# EAGLE design revision0 (EAGLE 7.2.0)
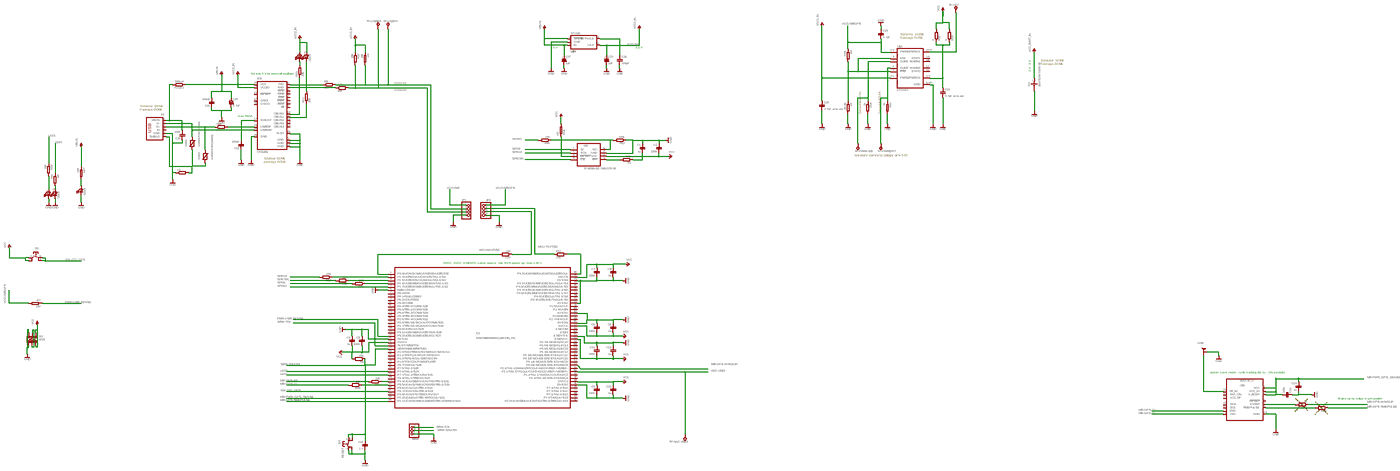
[diagram p0: schematic, sheet 1, overview]
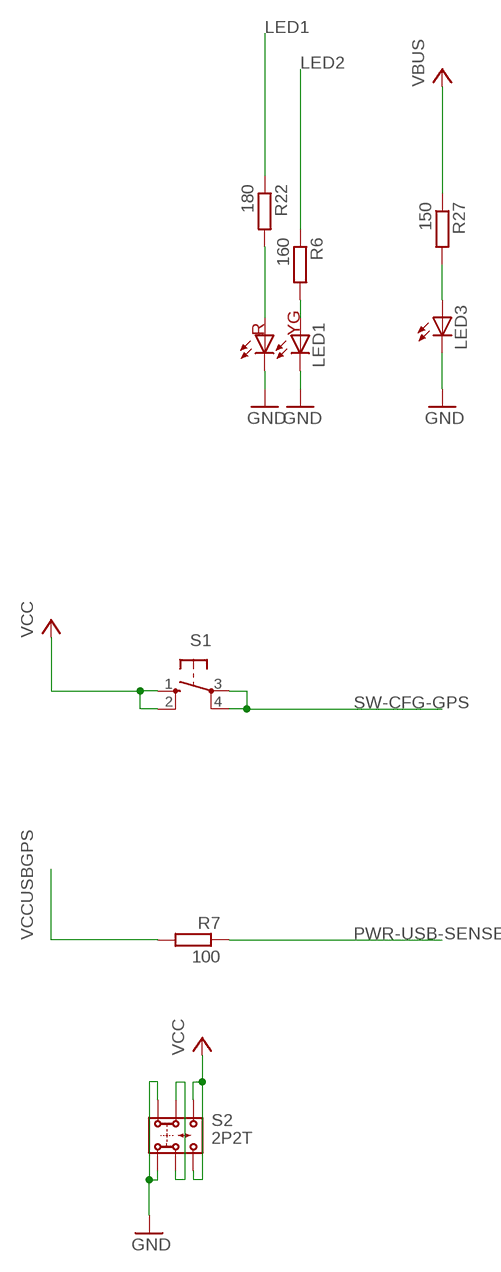
[diagram p1: schematic, sheet 1, part 1 of 4]
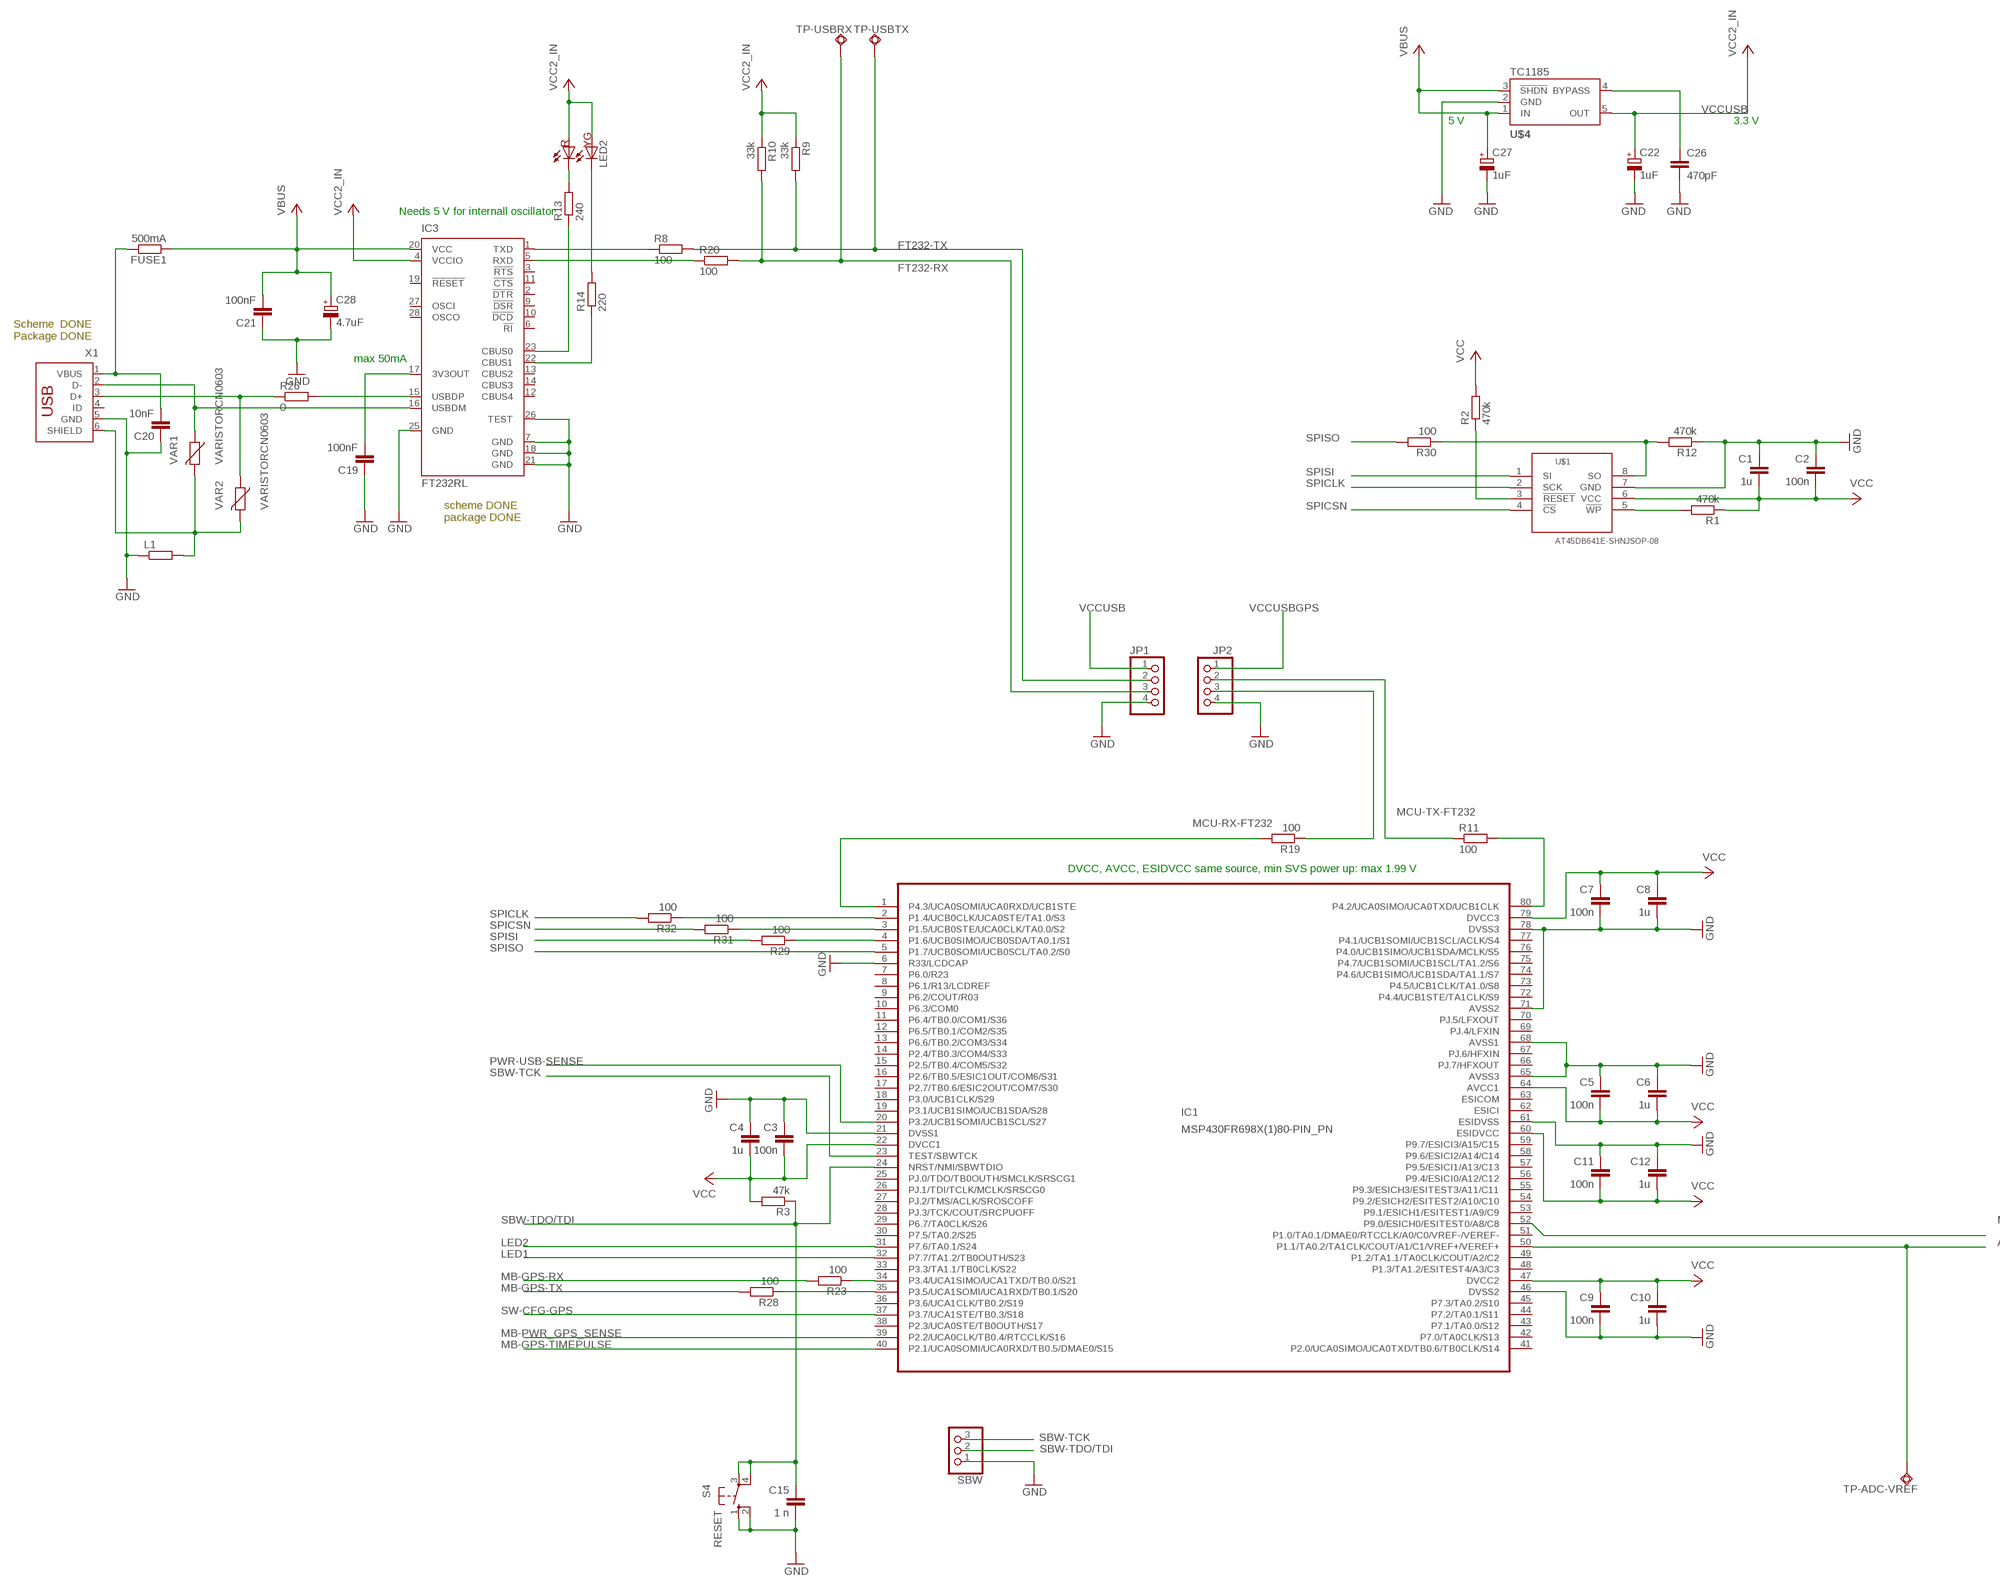
[diagram p2: schematic, sheet 1, part 2 of 4]
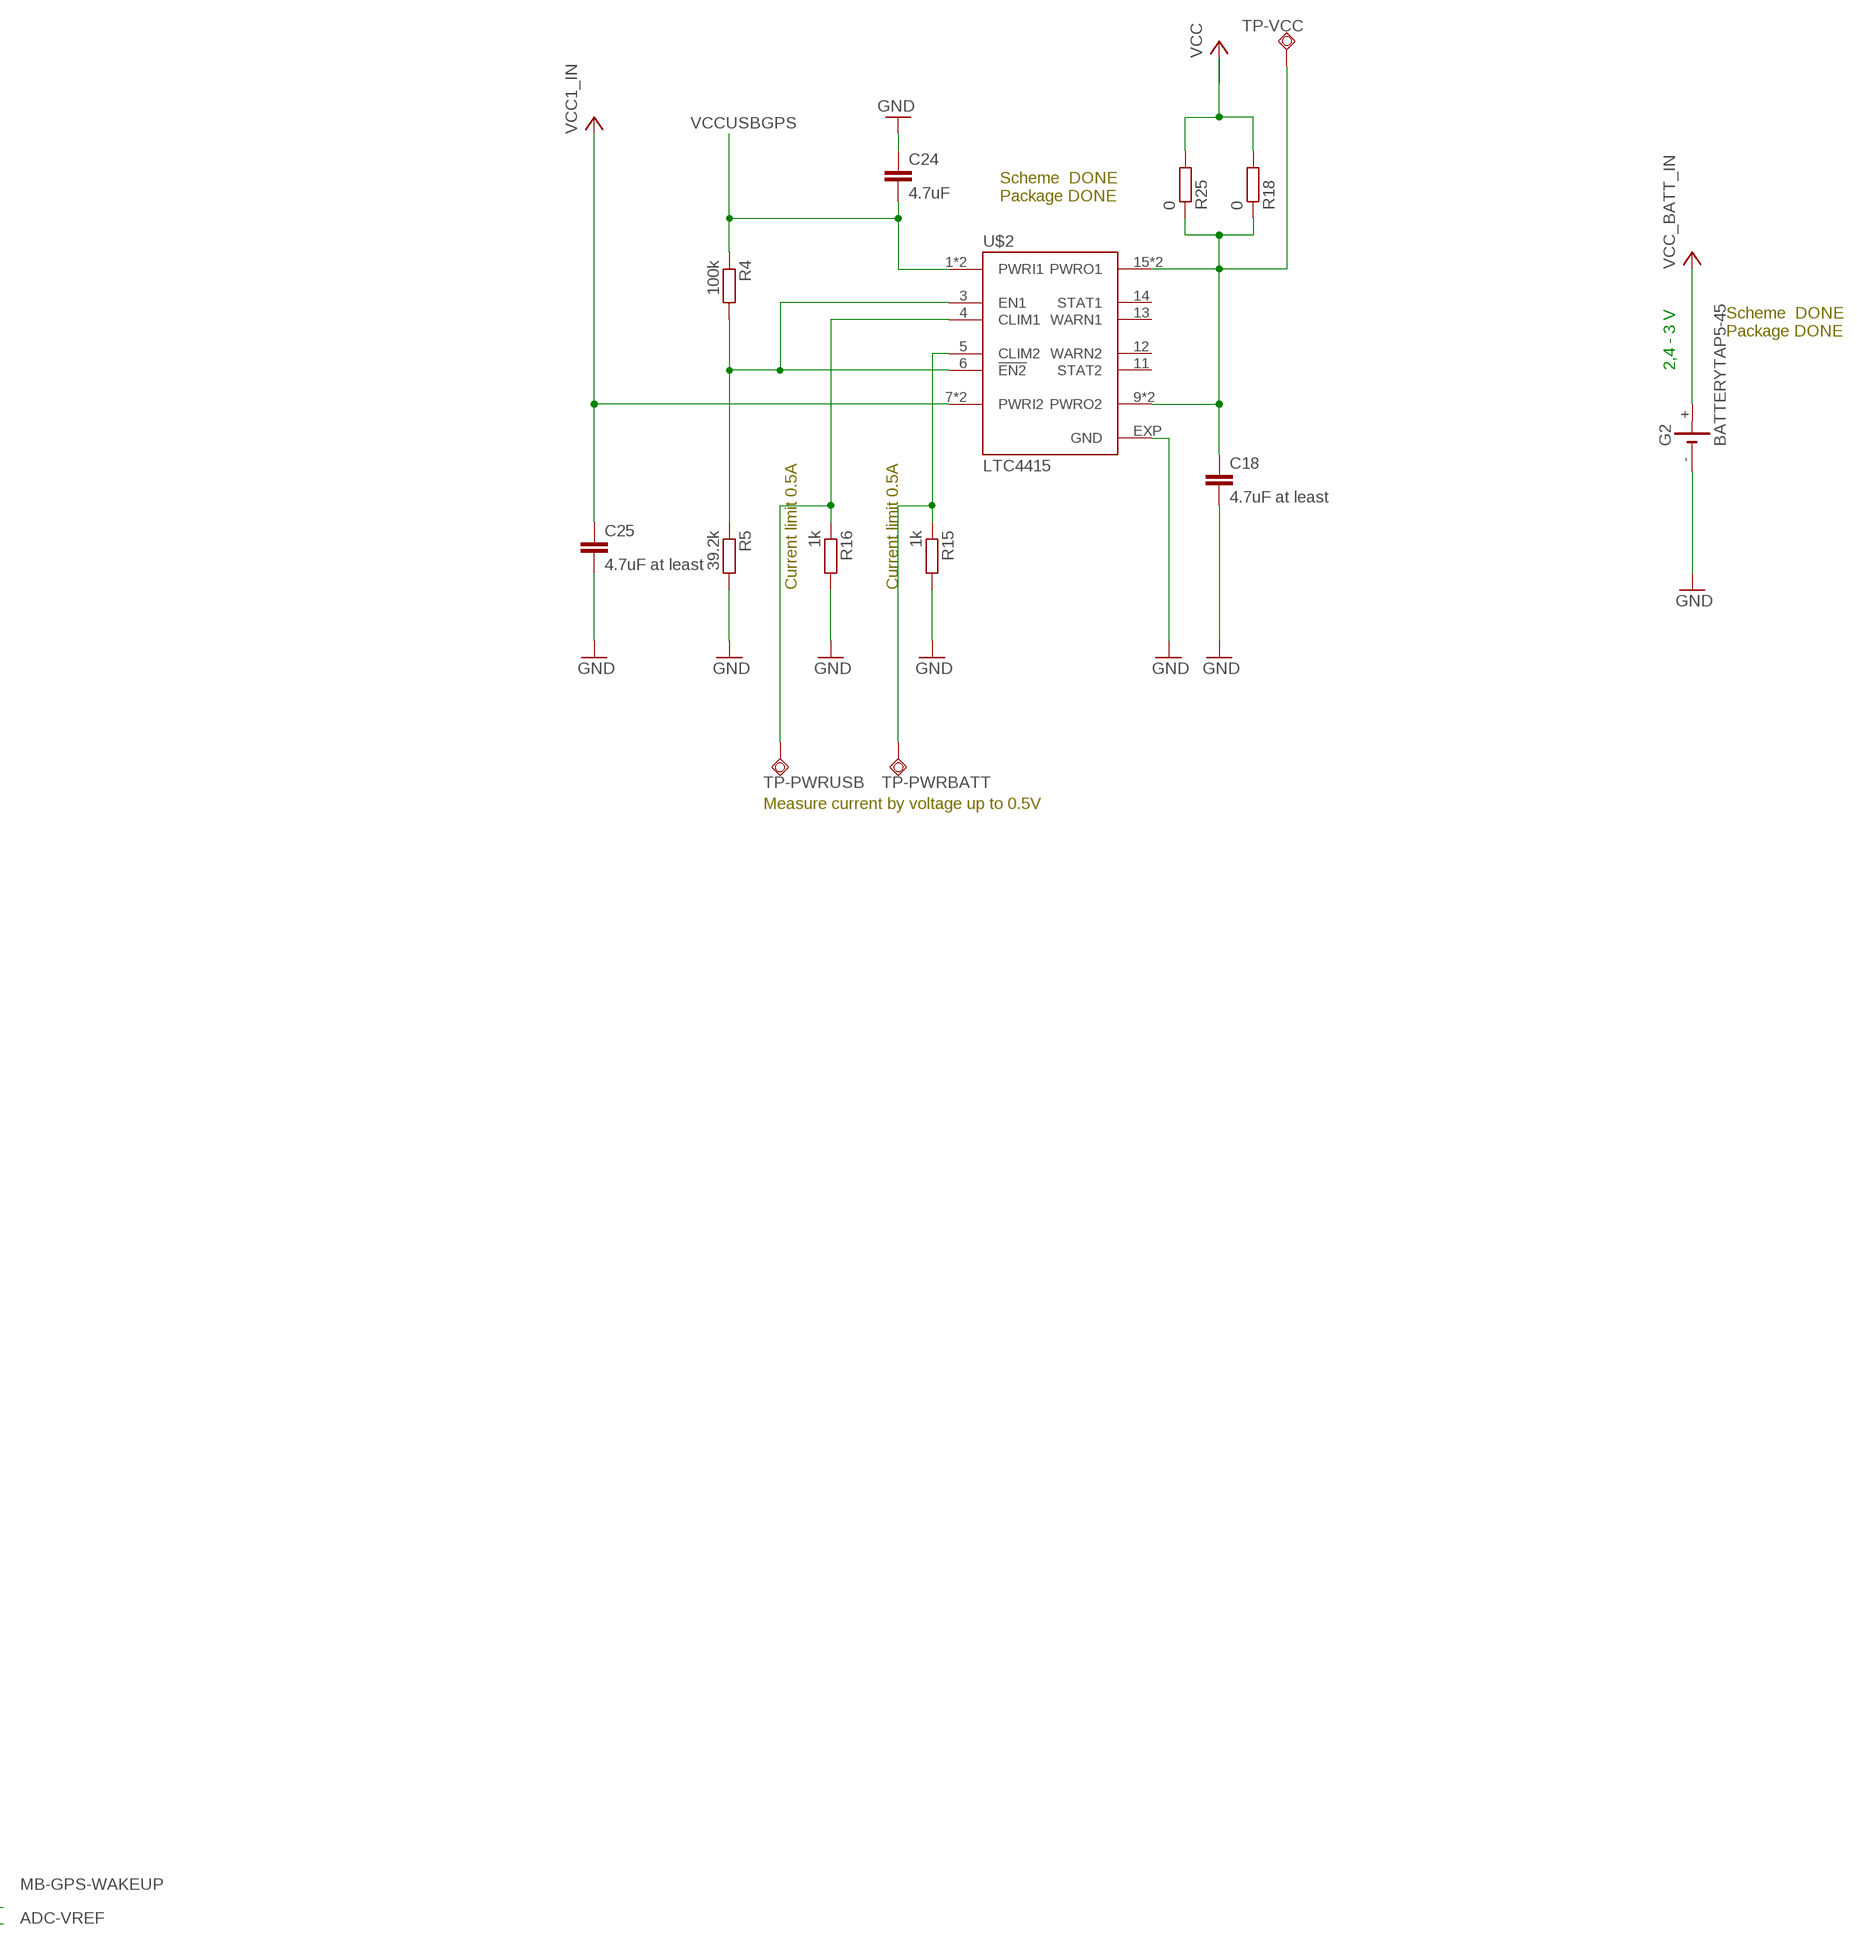
[diagram p3: schematic, sheet 1, part 3 of 4]
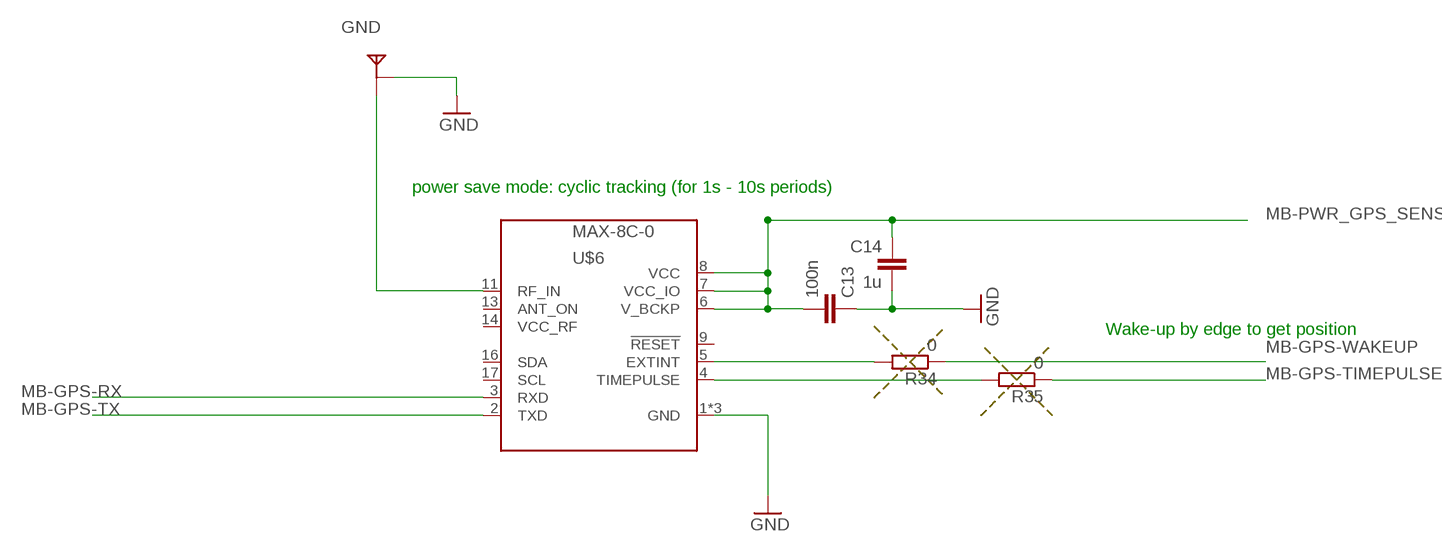
[diagram p4: schematic, sheet 1, part 4 of 4]

## Parts
C1  1u  C-EUC0603  [C0603]
C2  100n  C-EUC0603  [C0603]
C3  100n  C-EUC0603  [C0603]
C4  1u  C-EUC0603  [C0603]
C5  100n  C-EUC0603  [C0603]
C6  1u  C-EUC0603  [C0603]
C7  100n  C-EUC0603  [C0603]
C8  1u  C-EUC0603  [C0603]
C9  100n  C-EUC0603  [C0603]
C10  1u  C-EUC0603  [C0603]
C11  100n  C-EUC0603  [C0603]
C12  1u  C-EUC0603  [C0603]
C13  100n  C-EUC0603  [C0603]
C14  1u  C-EUC0603  [C0603]
C15  1 n  C-EUC0603  [C0603]
C18  4.7uF at least  C-EUC0805  [C0805]
C19  100nF  C-EUC0603  [C0603]
C20  10nF  C-EUC0603  [C0603]
C21  100nF  C-EUC0603  [C0603]
C22  1uF  CPOL-EUA/3216-18W  [A/3216-18W]
C24  4.7uF  C-EUC0805  [C0805]
C25  4.7uF at least  C-EUC0805  [C0805]
C26  470pF  C-EUC0603  [C0603]
C27  1uF  CPOL-EUA/3216-18W  [A/3216-18W]
C28  4.7uF  CPOL-EUA/3216-18W  [A/3216-18W]
FUSE1  500mA  R-EU_R0805  [R0805]
G2  BATTERYTAP5-45  [TAP5-45]
IC1  MSP430FR698X(1)80-PIN_PN  [PN_S-PQFP-G80]
IC3  FT232RL  [SSOP28]
JP1  PINHD-1X4  [1X04]
JP2  PINHD-1X4  [1X04]
L1  R-EU_R0603  [R0603]
LED1  BILEDBILED  [BILED]
LED2  BILEDBILED  [BILED]
LED3  LED_E  [LED_KINGBRIGHT0603]
R1  470k  R-EU_R0603  [R0603]
R2  470k  R-EU_R0603  [R0603]
R3  47k  R-EU_R0603  [R0603]
R4  100k  R-EU_R0603  [R0603]
R5  39.2k  R-EU_R0603  [R0603]
R6  160  R-EU_R0603  [R0603]
R7  100  R-EU_R0603  [R0603]
R8  100  R-EU_R0603  [R0603]
R9  33k  R-EU_R0603  [R0603]
R10  33k  R-EU_R0603  [R0603]
R11  100  R-EU_R0603  [R0603]
R12  470k  R-EU_R0603  [R0603]
R13  240  R-EU_R0603  [R0603]
R14  220  R-EU_R0603  [R0603]
R15  1k  R-EU_R0603  [R0603]
R16  1k  R-EU_R0603  [R0603]
R18  0  R-EU_R0603  [R0603]
R19  100  R-EU_R0603  [R0603]
R20  100  R-EU_R0603  [R0603]
R22  180  R-EU_R0603  [R0603]
R23  100  R-EU_R0603  [R0603]
R25  0  R-EU_R0603  [R0603]
R26  0  R-EU_R0603  [R0603]
R27  150  R-EU_R0603  [R0603]
R28  100  R-EU_R0603  [R0603]
R29  100  R-EU_R0603  [R0603]
R30  100  R-EU_R0603  [R0603]
R31  100  R-EU_R0603  [R0603]
R32  100  R-EU_R0603  [R0603]
R34  0  R-EU_R0603  [R0603]
R35  0  R-EU_R0603  [R0603]
S1  SWITCH-10-XX  [B3F-10XX]
S2  2P2T  [2P2T]
S4  RESET  SWITCH-10-XX  [B3F-10XX]
SBW  PINHD-1X3  [1X03]
TP-ADC-VREF  TPSQTP10R  [TP10R]
TP-PWRBATT  TPSQTP10R  [TP10R]
TP-PWRUSB  TPSQTP10R  [TP10R]
TP-USBRX  TPSQPAD1-13  [P1-13]
TP-USBTX  TPSQPAD1-13  [P1-13]
TP-VCC  TPSQPAD1-13  [P1-13]
U$1  AT45DB641E-SHNJSOP-08  [JSOP-08]
U$2  LTC4415  [MSOP16]
U$4  TC1185  [SOT23-5]
U$5  MWSL1251  [MWSL1251]
U$6  MAX-8C-0  [MAX-8]
VAR1  VARISTORCN0603  [CT/CN0603]
VAR2  VARISTORCN0603  [CT/CN0603]
X1  USB-787616  [USB]

## Nets
ADC-BATT: R15.1 TP-PWRBATT.TP U$2.5(CLIM2)
ADC-VREF: IC1.50(P1.1/TA0.2/TA1CLK/COUT/A1/C1/VREF+/VEREF+) TP-ADC-VREF.TP
FT232-RX: JP1.3 R10.2 R20.2 TP-USBRX.TP
FT232-TX: JP1.2 R8.2 R9.2 TP-USBTX.TP
GND: C1.1 C2.1 C3.1 C4.1 C5.1 C6.1 C7.2 C8.2 C9.2 C10.2 C11.1 C12.1 C13.1 C14.2 C15.2 C18.2 C19.1 C20.1 C21.1 C22.- C24.1 C25.2 C26.2 C27.- C28.- G2.- IC1.6(R33/LCDCAP) IC1.21(DVSS1) IC1.46(DVSS2) IC1.61(ESIDVSS) IC1.65(AVSS3) IC1.68(AVSS1) IC1.71(AVSS2) IC1.78(DVSS3) IC3.7(GND) IC3.18(GND) IC3.21(GND) IC3.25(GND) IC3.26(TEST) JP1.4 JP2.4 L1.1 LED1.1 LED1.3 LED3.C R5.2 R12.1 R15.2 R16.2 S2.1.1 S2.1.2 S4.1(S) S4.2(S1) SBW.1 U$1.7(GND) U$2.EXP(GND) U$4.2(GND) U$5.P$1(GND) U$5.P$3(GND) U$6.1(GND) U$6.10(GND) U$6.12(GND) X1.5(GND)
LED1: IC1.32(P7.7/TA1.2/TB0OUTH/S23) R22.1
LED2: IC1.31(P7.6/TA0.1/S24) R6.1
MB-GPS-RX: R23.2 U$6.3(RXD)
MB-GPS-TIMEPULSE: IC1.40(P2.1/UCA0SOMI/UCA0RXD/TB0.5/DMAE0/S15) R35.1
MB-GPS-TX: R28.2 U$6.2(TXD)
MB-GPS-WAKEUP: IC1.52(P9.0/ESICH0/ESITEST0/A8/C8) R34.1
MB-PWR_GPS_SENSE: C13.2 C14.1 IC1.39(P2.2/UCA0CLK/TB0.4/RTCCLK/S16) S2.2.1 S2.2.2 U$6.6(V_BCKP) U$6.7(VCC_IO) U$6.8(VCC)
MCU-RX-FT232: IC1.1(P4.3/UCA0SOMI/UCA0RXD/UCB1STE) R19.2
MCU-TX-FT232: JP2.2 R11.1
N$1: IC3.1(TXD) R8.1
N$2: IC1.80(P4.2/UCA0SIMO/UCA0TXD/UCB1CLK) R11.2
N$3: IC1.4(P1.6/UCB0SIMO/UCB0SDA/TA0.1/S1) R29.1
N$4: IC3.5(RXD) R20.1
N$5: R2.1 U$1.3(!RESET)
N$7: R4.2 R5.1 U$2.3(EN1) U$2.6(!EN2)
N$8: JP2.3 R19.1
N$10: C19.2 IC3.17(3V3OUT)
N$11: R1.2 U$1.5(!WP)
N$12: R26.1 VAR2.1 X1.3(D+)
N$13: IC3.16(USBDM) VAR1.1 X1.2(D-)
N$14: R12.2 R30.1 U$1.8(SO)
N$16: IC3.23(CBUS0) R13.1
N$17: IC3.22(CBUS1) R14.1
N$18: LED2.1 R13.2
N$19: LED2.3 R14.2
N$22: C20.2 FUSE1.2 X1.1(VBUS)
N$23: L1.2 VAR1.2 VAR2.2 X1.6(SHIELD)
N$24: IC1.2(P1.4/UCB0CLK/UCA0STE/TA1.0/S3) R32.1
N$25: R16.1 TP-PWRUSB.TP U$2.4(CLIM1)
N$26: C18.1 R18.1 R25.1 TP-VCC.TP U$2.9(PWRO2) U$2.10(PWRO2) U$2.15(PWRO1) U$2.16(PWRO1)
N$27 [charimp50]: U$5.P$2(FEED) U$6.11(RF_IN)
N$29: IC3.15(USBDP) R26.2
N$32: C26.1 U$4.4(BYPASS)
N$33: LED1.4 R6.2
N$34: LED1.2 R22.2
N$35: IC1.3(P1.5/UCB0STE/UCA0CLK/TA0.0/S2) R31.1
N$36: IC1.34(P3.4/UCA1SIMO/UCA1TXD/TB0.0/S21) R23.1
N$37: LED3.A R27.2
N$45: IC1.35(P3.5/UCA1SOMI/UCA1RXD/TB0.1/S20) R28.1
N$46: R34.2 U$6.5(EXTINT)
N$47: R35.2 U$6.4(TIMEPULSE)
PWR-USB-SENSE: IC1.20(P3.2/UCB1SOMI/UCB1SCL/S27) R7.1
SBW-TCK: IC1.23(TEST/SBWTCK) SBW.3
SBW-TDO/TDI: C15.1 IC1.24(NRST/NMI/SBWTDIO) R3.1 S4.3(P) S4.4(P1) SBW.2
SPICLK: R32.2 U$1.2(SCK)
SPICSN: R31.2 U$1.4(!CS)
SPISI: R29.2 U$1.1(SI)
SPISO: IC1.5(P1.7/UCB0SOMI/UCB0SCL/TA0.2/S0) R30.2
SW-CFG-GPS: IC1.37(P3.7/UCA1STE/TB0.3/S18) S1.3(P) S1.4(P1)
VBUS: C21.2 C27.+ C28.+ FUSE1.1 IC3.20(VCC) R27.1 U$4.1(IN) U$4.3(!SHDN)
VCC: C1.2 C2.2 C3.2 C4.2 C5.2 C6.2 C7.1 C8.1 C9.1 C10.1 C11.2 C12.2 IC1.22(DVCC1) IC1.47(DVCC2) IC1.60(ESIDVCC) IC1.64(AVCC1) IC1.79(DVCC3) R1.1 R2.2 R3.2 R18.2 R25.2 S1.1(S) S1.2(S1) S2.3.1 S2.3.2 U$1.6(VCC)
VCC_BATT_IN: C25.1 G2.+ U$2.7(PWRI2) U$2.8(PWRI2) ; supply symbol labelled VCC1_IN
VCCUSB: C22.+ IC3.4(VCCIO) JP1.1 LED2.2 LED2.4 R9.1 R10.1 U$4.5(OUT) ; supply symbol labelled VCC2_IN
VCCUSBGPS: C24.2 JP2.1 R4.1 R7.2 U$2.1(PWRI1) U$2.2(PWRI1)
Unconnected: IC1.7(P6.0/R23) IC1.8(P6.1/R13/LCDREF) IC1.9(P6.2/COUT/R03) IC1.10(P6.3/COM0) IC1.11(P6.4/TB0.0/COM1/S36) IC1.12(P6.5/TB0.1/COM2/S35) IC1.13(P6.6/TB0.2/COM3/S34) IC1.14(P2.4/TB0.3/COM4/S33) IC1.15(P2.5/TB0.4/COM5/S32) IC1.16(P2.6/TB0.5/ESIC1OUT/COM6/S31) IC1.17(P2.7/TB0.6/ESIC2OUT/COM7/S30) IC1.18(P3.0/UCB1CLK/S29) IC1.19(P3.1/UCB1SIMO/UCB1SDA/S28) IC1.25(PJ.0/TDO/TB0OUTH/SMCLK/SRSCG1) IC1.26(PJ.1/TDI/TCLK/MCLK/SRSCG0) IC1.27(PJ.2/TMS/ACLK/SROSCOFF) IC1.28(PJ.3/TCK/COUT/SRCPUOFF) IC1.29(P6.7/TA0CLK/S26) IC1.30(P7.5/TA0.2/S25) IC1.33(P3.3/TA1.1/TB0CLK/S22) IC1.36(P3.6/UCA1CLK/TB0.2/S19) IC1.38(P2.3/UCA0STE/TB0OUTH/S17) IC1.41(P2.0/UCA0SIMO/UCA0TXD/TB0.6/TB0CLK/S14) IC1.42(P7.0/TA0CLK/S13) IC1.43(P7.1/TA0.0/S12) IC1.44(P7.2/TA0.1/S11) IC1.45(P7.3/TA0.2/S10) IC1.48(P1.3/TA1.2/ESITEST4/A3/C3) IC1.49(P1.2/TA1.1/TA0CLK/COUT/A2/C2) IC1.51(P1.0/TA0.1/DMAE0/RTCCLK/A0/C0/VREF-/VEREF-) IC1.53(P9.1/ESICH1/ESITEST1/A9/C9) IC1.54(P9.2/ESICH2/ESITEST2/A10/C10) IC1.55(P9.3/ESICH3/ESITEST3/A11/C11) IC1.56(P9.4/ESICI0/A12/C12) IC1.57(P9.5/ESICI1/A13/C13) IC1.58(P9.6/ESICI2/A14/C14) IC1.59(P9.7/ESICI3/A15/C15) IC1.62(ESICI) IC1.63(ESICOM) IC1.66(PJ.7/HFXOUT) IC1.67(PJ.6/HFXIN) IC1.69(PJ.4/LFXIN) IC1.70(PJ.5/LFXOUT) IC1.72(P4.4/UCB1STE/TA1CLK/S9) IC1.73(P4.5/UCB1CLK/TA1.0/S8) IC1.74(P4.6/UCB1SIMO/UCB1SDA/TA1.1/S7) IC1.75(P4.7/UCB1SOMI/UCB1SCL/TA1.2/S6) IC1.76(P4.0/UCB1SIMO/UCB1SDA/MCLK/S5) IC1.77(P4.1/UCB1SOMI/UCB1SCL/ACLK/S4) IC3.2(!DTR) IC3.3(!RTS) IC3.6(!RI) IC3.9(!DSR) IC3.10(!DCD) IC3.11(!CTS) IC3.12(CBUS4) IC3.13(CBUS2) IC3.14(CBUS3) IC3.19(!RESET) IC3.27(OSCI) IC3.28(OSCO) U$2.11(STAT2) U$2.12(WARN2) U$2.13(WARN1) U$2.14(STAT1) U$6.9(!RESET) U$6.13(ANT_ON) U$6.14(VCC_RF) U$6.16(SDA) U$6.17(SCL) X1.4(ID)

## Notes on the sheet
- Scheme  DONE
  Package DONE
- 5 V | 3.3 V
- Scheme  DONE
  Package DONE
- 2,4 - 3 V
- Needs 5 V for internall oscillator
- Scheme  DONE
  Package DONE
- Current limit 0.5A | Current limit 0.5A
- max 50mA
- Measure current by voltage up to 0.5V
- scheme DONE
  package DONE
- DVCC, AVCC, ESIDVCC same source, min SVS power up: max 1.99 V
- power save mode: cyclic tracking (for 1s - 10s periods)
- Wake-up by edge to get position

## Library data of the parts
C1-C15 C18-C21 C24-C26 = tagps:C-EU: CAPACITOR, European symbol; SPICEPREFIX: C
C22 C27 C28 = tagps:CPOL-EU: POLARIZED CAPACITOR, European symbol
FUSE1 L1 R1-R16 R18-R20 R22 R23 R25-R32 R34 R35 = tagps:R-EU_: RESISTOR, European symbol; SPICEPREFIX: R
G2 = tagps:BATTERY: LI BATTERY Sonnenschein
IC1 = tagps:MSP430FR698X(1): Ultra-Low-Power MCU Source: http://www.ti.com/lit/ds/symlink/msp430fr6989.pdf
IC3 = tagps:FT232R: Source: http://www.ftdichip.com/Documents/DataSheets/DS_FT232R_v104.pdf; MPN: FT232RL; OC_FARNELL: 1146032; OC_NEWARK: 91K9918
JP1 JP2 = tagps:PINHD-1X4: PIN HEADER
LED1 LED2 = tagps:BILED: LED Source: http://www.osram.convergy.de Source: www.luxeon.com Source: www.kingbright.com
LED3 = tagps:LED_E: LED Source: http://www.osram.convergy.de Source: www.luxeon.com Source: www.kingbright.com
S1 S4 = tagps:SWITCH-10-XX: OMRON SWITCH; MPN: B3F-1000; OC_FARNELL: 176432; OC_NEWARK: 36M3542
S2 = tagps:2P2T: SLIDE SWITCH 2P2T Part No. SS-22F05-G(A)4 Source: CANAL ELECTRONIC CO., LTD .. switsch.pdf
SBW = tagps:PINHD-1X3: PIN HEADER
TP-ADC-VREF TP-PWRBATT TP-PWRUSB TP-USBRX TP-USBTX TP-VCC = tagps:TPSQ: Test pad
U$1 = tagps:AT45DB641E-SHN
U$2 = tagps:LTC4415
U$4 = tagps:TC1185
U$5 = tagps:MWSL1251
U$6 = tagps:MAX-8C-0
VAR1 VAR2 = tagps:VARISTOR: VARISTOR
X1 = tagps:USB-787616: AMP connector

## Net classes
0 signal: width 0.254 mm, drill 0.254 mm, clearance 0.1 mm
1 charimp50: width 0.254 mm, drill 0.254 mm, clearance 0.1 mm
2 conect: width 0.254 mm, drill 0.254 mm

## Board
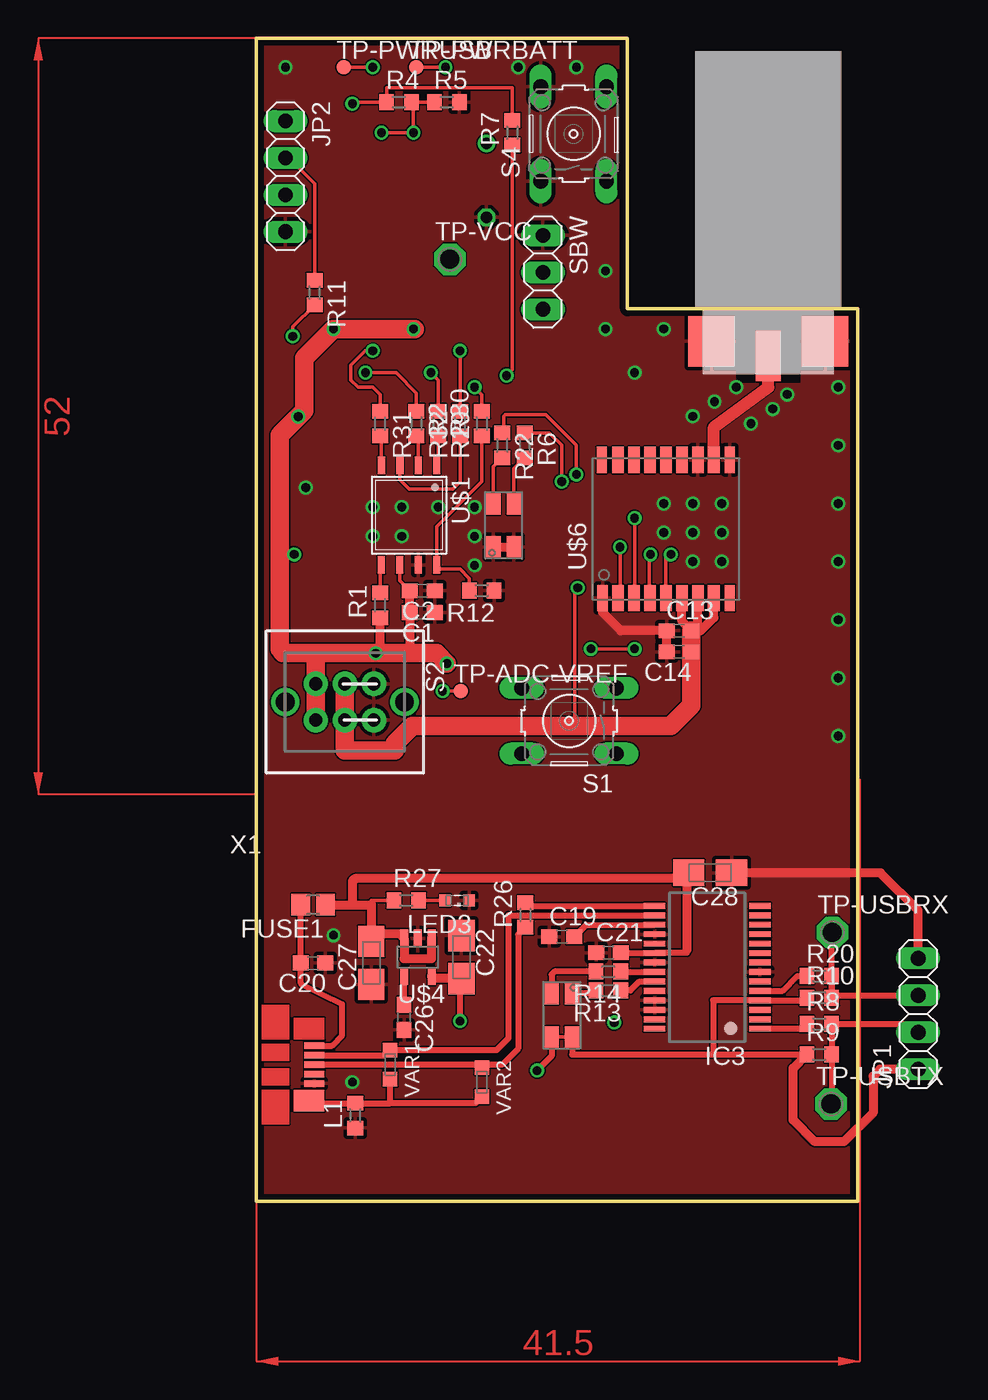
[diagram p5: board, top side]
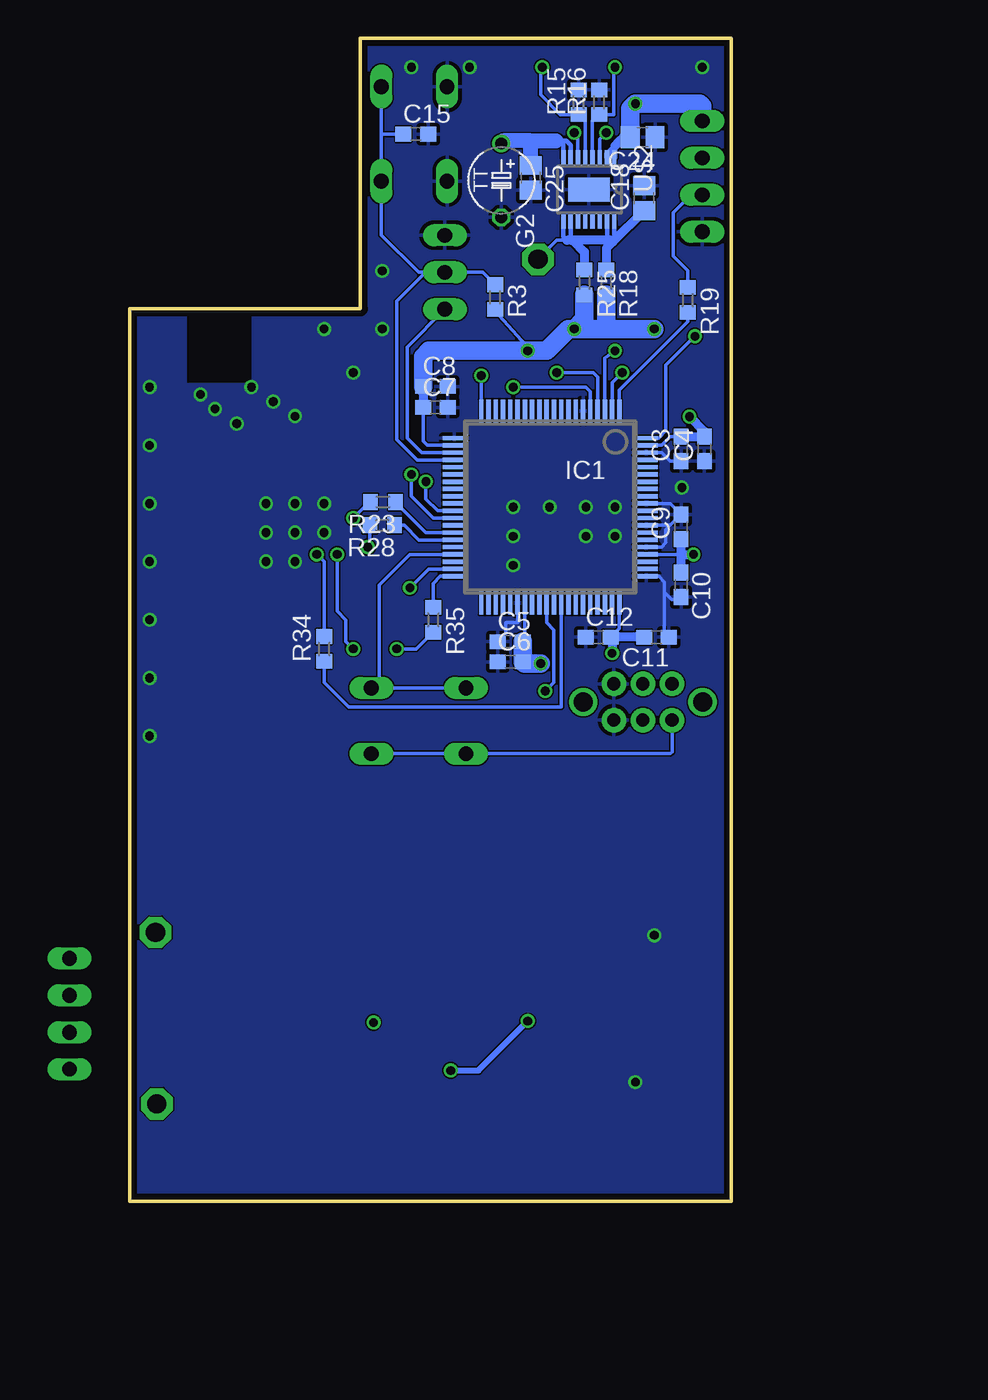
[diagram p6: board, bottom side, seen from below]

Size 41.35 x 80 mm. Coordinates in mm from the lower left corner, seen from the top.
Outline: 0,0 41.35,0 41.35,61.4 25.5,61.4 25.5,80 0,80 0,0
Copper layers (1*16): Top 0.0356mm / dielectric 1.5011mm / Bottom 0.0356mm
Design rules "LaenPCBOrder *": minimum track width 6mil, minimum drill 13mil, track to track 1mil, track to pad 1mil, pad to pad 1mil, via to via 1mil, smd to smd 1mil, copper to edge 15mil, drill to drill 6mil, minimum pad ring 7mil, minimum via ring 7mil, stop-mask expansion 0mil, vias tented up to drill 0mil, thermal gap 10mil

### Footprints (pad centres in the part's own frame; a part is rotated, then mirrored left to right if it is on the bottom)
C0603 = smd 1.1 x 1: 1 -0.85,0; 2 0.85,0
C0805 = smd 1.3 x 1.5: 1 -0.85,0; 2 0.85,0
A/3216-18W = smd 2.15 x 1.8: + 1.475,0; - -1.475,0
R0805 = smd 1.3 x 1.5: 1 -0.85,0; 2 0.85,0
TAP5-45 = drill 0.813: + -2.54,0 | drill 0.813 octagon: - 2.54,0
PN_S-PQFP-G80 = smd 0.3 x 1.6: 1 -4.75,-6.6; 2 -4.25,-6.6; 3 -3.75,-6.6; 4 -3.25,-6.6; 5 -2.75,-6.6; 6 -2.25,-6.6; 7 -1.75,-6.6; 8 -1.25,-6.6; 9 -0.75,-6.6; 10 -0.25,-6.6; 11 0.25,-6.6; 12 0.75,-6.6; 13 1.25,-6.6; 14 1.75,-6.6; 15 2.25,-6.6; 16 2.75,-6.6; 17 3.25,-6.6; 18 3.75,-6.6; 19 4.25,-6.6; 20 4.75,-6.6; 41 4.75,6.6; 42 4.25,6.6; 43 3.75,6.6; 44 3.25,6.6; 45 2.75,6.6; 46 2.25,6.6; 47 1.75,6.6; 48 1.25,6.6; 49 0.75,6.6; 50 0.25,6.6; 51 -0.25,6.6; 52 -0.75,6.6; 53 -1.25,6.6; 54 -1.75,6.6; 55 -2.25,6.6; 56 -2.75,6.6; 57 -3.25,6.6; 58 -3.75,6.6; 59 -4.25,6.6; 60 -4.75,6.6 | smd 1.6 x 0.3: 21 6.6,-4.75; 22 6.6,-4.25; 23 6.6,-3.75; 24 6.6,-3.25; 25 6.6,-2.75; 26 6.6,-2.25; 27 6.6,-1.75; 28 6.6,-1.25; 29 6.6,-0.75; 30 6.6,-0.25; 31 6.6,0.25; 32 6.6,0.75; 33 6.6,1.25; 34 6.6,1.75; 35 6.6,2.25; 36 6.6,2.75; 37 6.6,3.25; 38 6.6,3.75; 39 6.6,4.25; 40 6.6,4.75; 61 -6.6,4.75; 62 -6.6,4.25; 63 -6.6,3.75; 64 -6.6,3.25; 65 -6.6,2.75; 66 -6.6,2.25; 67 -6.6,1.75; 68 -6.6,1.25; 69 -6.6,0.75; 70 -6.6,0.25; 71 -6.6,-0.25; 72 -6.6,-0.75; 73 -6.6,-1.25; 74 -6.6,-1.75; 75 -6.6,-2.25; 76 -6.6,-2.75; 77 -6.6,-3.25; 78 -6.6,-3.75; 79 -6.6,-4.25; 80 -6.6,-4.75
SSOP28 = smd 0.4 x 1.5: 1 -4.225,-3.625; 2 -3.575,-3.625; 3 -2.925,-3.625; 4 -2.275,-3.625; 5 -1.625,-3.625; 6 -0.975,-3.625; 7 -0.325,-3.625; 8 0.325,-3.625; 9 0.975,-3.625; 10 1.625,-3.625; 11 2.275,-3.625; 12 2.925,-3.625; 13 3.575,-3.625; 14 4.225,-3.625; 15 4.225,3.625; 16 3.575,3.625; 17 2.925,3.625; 18 2.275,3.625; 19 1.625,3.625; 20 0.975,3.625; 21 0.325,3.625; 22 -0.325,3.625; 23 -0.975,3.625; 24 -1.625,3.625; 25 -2.275,3.625; 26 -2.925,3.625; 27 -3.575,3.625; 28 -4.225,3.625
1X04 = drill 1.016 long: 1 -3.81,0; 2 -1.27,0; 3 1.27,0; 4 3.81,0
R0603 = smd 1 x 1.1: 1 -0.85,0; 2 0.85,0
BILED = smd 1.5 x 1: 1 -1.5,0.7; 2 1.5,0.7; 3 -1.5,-0.7; 4 1.5,-0.7
LED_KINGBRIGHT0603 = smd 0.8 x 0.8: A 0.825,0; C -0.825,0
B3F-10XX = drill 1.016 long: 1 -3.251,2.261; 2 3.251,2.261; 3 -3.251,-2.261; 4 3.251,-2.261
2P2T = drill 0.9 pad 1.676: 1.1 -2,1.25; 1.2 -2,-1.25; 2.1 0,1.25; 2.2 0,-1.25; 3.1 2,1.25; 3.2 2,-1.25 | drill 1.3 pad 1.93: 3.3 4.1,0; 3.4 -4.1,0
1X03 = drill 1.016 long: 1 -2.54,0; 2 0,0; 3 2.54,0
TP10R = smd 1 x 1: TP 0,0
P1-13 = drill 1.321 pad 2.159 octagon: TP 0,0
JSOP-08 = smd 0.5 x 1.2: 1 -1.905,-3.429; 2 -0.635,-3.429; 3 0.635,-3.429; 4 1.905,-3.429; 5 1.913,3.429; 6 0.643,3.429; 7 -0.627,3.429; 8 -1.897,3.429
MSOP16 = smd 1 x 0.3: 1 -2.2,1.75; 2 -2.2,1.25; 3 -2.2,0.75; 4 -2.2,0.25; 5 -2.2,-0.25; 6 -2.2,-0.75; 7 -2.2,-1.25; 8 -2.2,-1.75; 9 2.2,-1.75; 10 2.2,-1.25; 11 2.2,-0.75; 12 2.2,-0.25; 13 2.2,0.25; 14 2.2,0.75; 15 2.2,1.25; 16 2.2,1.75 | smd 1.65 x 2.85: EXP 0,0
SOT23-5 = smd 0.55 x 1.2: 1 -0.95,-1.3; 2 0,-1.3; 3 0.95,-1.3; 4 0.95,1.3; 5 -0.95,1.3
MWSL1251 = smd 3.2 x 3.5: P$1 -3.9,-2.25; P$3 3.9,-2.25 | smd 1.7 x 3.5: P$2 0,-3.25
MAX-8 = smd 1.8 x 0.7: 1 9.6,0.7; 9 9.6,9.45; 10 0.1,9.45; 18 0.1,0.65 | smd 1.8 x 0.8: 2 9.6,1.75; 3 9.6,2.85; 4 9.6,3.95; 5 9.6,5.05; 6 9.6,6.15; 7 9.6,7.25; 8 9.6,8.35; 11 0.1,8.35; 12 0.1,7.25; 13 0.1,6.15; 14 0.1,5.05; 15 0.1,3.95; 16 0.1,2.85; 17 0.1,1.75
CT/CN0603 = smd 1 x 1: 1 -1,0; 2 1,0
USB = smd 1.38 x 0.45: 1 -0.69,1.3; 2 -0.69,0.65; 3 -0.69,0; 4 -0.69,-0.65; 5 -0.69,-1.3 | smd 2.1 x 1.5: 6 -1.05,-2.47

### Placement (x,y rotation side)
C1  11.4,40.5 180 top
C2  11.4,42 180 top
C3  3.45,51.75 90 bottom
C4  1.85,51.75 90 bottom
C5  15.2,38.5 0 bottom
C6  15.2,37.1 0 bottom
C7  20.35,54.6 0 bottom
C8  20.35,56.05 0 bottom
C9  3.45,46.4 90 bottom
C10  3.45,42.4 270 bottom
C11  5.15,38.8 180 bottom
C12  9.15,38.8 0 bottom
C13  29.05,39.25 0 top
C14  29.05,37.8 180 top
C15  21.7,73.4 0 bottom
C18  6,69 90 bottom
C19  21,18.2 0 top
C20  3.9,16.4 180 top
C21  24.2,17.1 0 top
C22  14.1,16.8 270 top
C24  6.1,73.2 180 bottom
C25  13.8,70.4 270 bottom
C26  10.15,12.65 270 top
C27  7.9,16.4 90 top
C28  31.2,22.6 180 top
FUSE1  3.9,20.4 180 top
G2  15.82,70.22 270 bottom
IC1  12.45,47.75 180 bottom
IC3  31,16.1 90 top
JP1  45.5,12.9 90 top  (outside the outline)
JP2  2,70.5 270 top
L1  6.8,5.9 90 top
LED1  17,46.5 90 top
LED2  21,12.8 270 top
LED3  13.8,20.7 180 top
R1  8.5,41 90 top
R2  14,53.5 90 top
R3  16.25,62.2 270 bottom
R4  9.8,75.6 0 top
R5  13.1,75.6 0 top
R6  18.45,52 270 top
R7  17.6,73.5 90 top
R8  38.7,12.2 0 top
R9  38.7,10.1 0 top
R10  38.7,14 0 top
R11  4,62.5 270 top
R12  15.5,42 180 top
R13  24.2,14.5 180 top
R14  24.2,15.8 180 top
R15  10.5,75.6 90 bottom
R16  9.1,75.6 90 bottom
R18  8.6,63.2 270 bottom
R19  3,62 270 bottom
R20  38.7,15.5 0 top
R22  16.9,52 270 top
R23  23.95,48.1 180 bottom
R25  10.1,63.2 270 bottom
R26  18.5,19.7 90 top
R27  10.3,20.7 0 top
R28  24,46.5 180 bottom
R29  12.5,53.5 270 top
R30  15.5,53.5 90 top
R31  8.5,53.5 270 top
R32  11,53.5 270 top
R34  28,38 90 bottom
R35  20.5,40 270 bottom
S1  21.5,33.05 180 top
S2  6.08,34.35 180 top
S4  21.81,73.42 90 top
SBW  19.7,63.9 270 top
TP-ADC-VREF  14.05,35.1 0 top
TP-PWRBATT  11,78 0 top
TP-PWRUSB  6,78 0 top
TP-USBRX  39.6,18.5 0 top
TP-USBTX  39.5,6.7 0 top
TP-VCC  13.3,64.8 0 top
U$1  10.5,47.2 180 top
U$2  9.8,69.6 270 bottom
U$4  11.1,16.8 180 top
U$5  35.2,61.4 0 top
U$6  23.1,51.1 270 top
VAR1  9.2,9.4 270 top
VAR2  15.5,8.2 270 top
X1  4.67,9.4 0 top

### Tracks (layer width: path | path; a pad name or v marks a point on that pad's centre or on a via)
ADC-BATT  (via drill 0.6)
  Top 0.254: v13,78 TP-PWRBATT.TP
  Bottom 0.254: U$2.5 10.05,74.3 arc-90 R15.1 11.75,74.75 13.1,76.1 13.1,77.9 v13,78
ADC-VREF  (via drill 0.6)
  Top 0.254: TP-ADC-VREF.TP v12.8,35.1
  Bottom 0.254: 12.7,35.2 v12.8,35.1 12.2,35.7 12.2,39.3 12.7,39.8 IC1.50
FT232-RX
  Top 0.406: R10.2 39.72,14.17 JP1.3 | R20.2 R10.2 | R10.2 39.55,18.45 TP-USBRX.TP
FT232-TX
  Top 0.406: JP1.2 44.93,12.2 R8.2 R9.2 39.55,6.75 TP-USBTX.TP
GND  (via drill 0.6)
  Top 0.61: LED1.1 LED1.3 | U$6.1 23.8,40.5 25.05,39.25 C13.1 C14.2 | JP1.4 45.5,20 42.9,22.6 C28.-
  Bottom 0.254: 19.2,52.5 IC1.21 | 16.2,38.85 C5.1 15.5,39.05 15.5,39.8 14.7,39.8 IC1.46 | IC1.61 5,43 4.6,42.6 4.6,41.9 | 4.6,41.9 4.1,41.4 3.6,41.4 C10.2 | IC1.78 4.8,51.5 4.2,50.9 C3.1 | 4.3,38.9 4.6,39.2 4.6,41.9 | IC1.71 4.2,48 C9.2 4.2,46.5 | IC1.68 4.2,46.5 | IC1.65 4.8,45 4.5,45.3 4.5,46.2 4.2,46.5
  other vias: 3.4,49.1 15,43.75 8,45.75 10,45.75 15,45.75 15,47.75 12.5,47.75 10,47.75 8,47.75 5.3,18.3 6.6,8.2 33,56 22,78 18,78 2,78 40,36 40,32 31.5,55 30,54 36.5,55.5 35.5,54.5 34,53.5 40,40 40,44 40,48 40,52 40,56 28,60 24,60 24,64 32,48 30,48 28,48 32,46 32,44 30,46 30,44 28,46 26,57
  pour Top: -1.65,80.95 41.05,80.85 41.15,-1.5 -1.35,-1.5
  pour Bottom: -0.55,80.25 41.7,80.25 41.3,-0.8 -1.2,-0.9 -0.7,27.25 -0.65,29.75
LED1  (via drill 0.6)
  Top 0.254: R22.1 17,52.95 17,54 17.1,54.1 19.9,54.1 22,52 v22,50
  Bottom 0.254: IC1.32 20.5,47 22,48.5 v22,50
LED2  (via drill 0.6)
  Top 0.254: v21,49.5 21,52 20.15,52.85 R6.1
  Bottom 0.254: IC1.31 20.2,47.5 21,48.3 v21,49.5
MB-GPS-RX  (via drill 0.6)
  Top 0.254: U$6.3 26,41.55 v26,47
  Bottom 0.254: v26,47 24.9,48.1 R23.2
MB-GPS-TIMEPULSE
  Bottom 0.254: IC1.40 20,43 20.5,42.5 R35.1
MB-GPS-TX  (via drill 0.6)
  Top 0.254: U$6.2 25,41.65 v25,45
  Bottom 0.254: v25,45 24.85,45.15 R28.2
MB-GPS-WAKEUP
  Bottom 0.254: IC1.52 11.7,34 26.3,34 28,35.7 R34.1
MB-PWR_GPS_SENSE  (via drill 0.6)
  Top 0.254: v22.1,42.2 21.9,42 21.9,32.7 | 30.55,39.25 C13.2
  Top 0.61: U$6.7 30.35,39.7 C13.2 29.25,39.9 U$6.6 | 30.55,39.25 31.45,40.15 U$6.8
  Top 1.27: C13.2 C14.1 29.9,34.1 28.5,32.7 21.9,32.7 10.7,32.7 9.5,31.5 9.5,31 6.08,31 S2.2.1 S2.2.2
  Bottom 0.254: IC1.39 20.8,43.5 v22.1,42.2
MCU-RX-FT232
  Bottom 0.254: IC1.1 7.7,55.8 3,60.5 R19.2
MCU-TX-FT232
  Top 0.254: JP2.2 2.23,71.77 4,70 R11.1
N$1
  Top 0.406: R8.1 37.52,11.88 IC3.1
N$2  (via drill 0.6)
  Top 0.254: R11.2 2.5,60.15 v2.5,59.5
  Bottom 0.254: IC1.80 5,52.5 4.5,53 4.5,57.5 v2.5,59.5
N$3  (via drill 0.6)
  Top 0.254: v12,57 12.5,56.5 R29.1
  Bottom 0.254: IC1.4 9.2,56.7 9.5,57 v12,57
N$4
  Top 0.406: IC3.5 36.17,14.47 37.2,15.5 R20.1
N$5
  Top 0.254: U$1.3 9.87,49.63 10.5,49 13.5,49 14,49.5 R2.1
N$7  (via drill 0.6)
  Top 0.254: R4.2 10.8,75.6 | 10.8,75.6 v10.8,73.5 v8.6,73.5 | 10.8,75.6 R5.1
  Bottom 0.254: 10.6,73.5 10.55,73.5 U$2.6 10.55,73.45 10.6,73.5 | 10.6,73.5 v10.8,73.5 | v8.6,73.5 9.05,73.05 U$2.3
N$8
  Bottom 0.254: JP2.3 2.77,69.23 4,68 4,65 3,64 R19.1
N$10
  Top 0.406: C19.2 22.68,19.02 IC3.17
N$11
  Top 0.254: U$1.5 8.5,43.68 R1.2
N$12
  Top 0.406: 15.4,9.4 16.9,9.4 18,10.5 18,18.35 R26.1 | 15.4,9.4 X1.3 | VAR2.1 15.4,9.3 15.4,9.4
N$13
  Top 0.406: IC3.16 17.32,19.68 17.32,11.22 16.5,10.4 VAR1.1 8.85,10.05 X1.2
N$14
  Top 0.254: R30.1 15.5,49.5 12.4,46.4 U$1.8 | 12.5,43.67 U$1.8 | R12.2 14.65,42.85 14,43.5 12.67,43.5 U$1.8
N$16
  Top 0.406: IC3.23 26.33,15.12 25.7,14.5 R13.1
N$17
  Top 0.406: R14.1 25.35,15.7 arc-45 25.53,15.78 IC3.22
N$18
  Top 0.254: 21.7,13.9 LED2.1
  Top 0.406: R13.2 arc-90 23.15,14.3 LED2.1
N$19
  Top 0.406: R14.2 20.5,15.8 20.3,15.6 LED2.3
N$22
  Top 0.406: X1.1 5.2,10.7 5.9,11.4 5.9,13.55 3.15,14.9 3.05,15 C20.2 FUSE1.2
N$23
  Top 0.406: X1.6 3.8,6.75 L1.2 9.2,6.75 | 9.2,6.75 VAR1.2 | VAR2.2 15.05,6.75 9.2,6.75
N$24  (via drill 0.6)
  Top 0.254: R32.1 11,55.6 9.6,57 v7.5,57
  Bottom 0.254: IC1.2 8.2,56.3 v7.5,57
N$25  (via drill 0.6)
  Top 0.254: v8,78 TP-PWRUSB.TP
  Bottom 0.254: U$2.4 9.55,74.3 arc90 R16.1 8.1,74.75 8.1,77.9 v8,78
N$26
  Bottom 0.254: TP-VCC.TP 12,66.1 11,66.1
  Bottom 0.305: U$2.9 11.55,66.35 11.3,66.1 11.05,66.35 U$2.10 | 5.5,68 5.65,68.15 C18.1 arc-90 6.3,67.85 | U$2.15 8.55,66.35 8.3,66.1 8.05,66.35 U$2.16
  Bottom 0.61: 8.15,66 C18.1 | 8.15,66 8.25,66.1 8.3,66.1 10.9,66.1 | 10.9,66.1 11,66.1 11.3,66.1 | 8.15,66 8.6,65.55 R18.1 | 10.9,66.1 10.1,65.3 R25.1
N$27
  Top 0.813: U$6.11 31.45,53.25 35.2,56 U$5.P$2
N$29
  Top 0.406: R26.2 18.73,20.32 IC3.15
N$30  (via drill 0.6)
  other vias: 24.6,12.3
N$32
  Top 0.406: 10.2,15.5 U$4.4 C26.1
N$33
  Top 0.254: R6.2 17.7,50.4 LED1.4
N$34
  Top 0.254: R22.2 16.3,50.55 LED1.2
N$35  (via drill 0.6)
  Top 0.254: R31.1 8.5,55.5 8,56 7,56 6.5,56.5 6.5,57.5 7.5,58.5 v8,58.5
  Bottom 0.254: IC1.3 8.7,58 v8,58.5
N$36
  Bottom 0.254: IC1.34 21,46 R23.1
N$37
  Top 0.254: R27.2 LED3.A
N$45
  Bottom 0.254: IC1.35 21.5,45.5 22.5,46.5 R28.1
N$46  (via drill 0.6)
  Top 0.254: U$6.5 28.15,44.25 v28.5,44.5
  Bottom 0.254: v28.5,44.5 28,44 R34.2
N$47  (via drill 0.6)
  Top 0.254: U$6.4 27,41.55 27,44.4 v27.1,44.5 | v23,38 v26,38
  Bottom 0.254: v27.1,44.5 27.1,40.6 26.5,40 26.5,38.5 v26,38 | R35.2 21.65,38 v23,38
PWR-USB-SENSE  (via drill 0.6)
  Top 0.254: 17.8,72.65 R7.1 17.6,57.2 v17.2,56.8
  Bottom 0.254: 17.2,53.75 IC1.20 v17.2,56.8
SBW-TCK
  Bottom 0.254: IC1.23 21.3,51.5 22.3,52.5 22.3,58.76 SBW.3
SBW-TDO/TDI
  Bottom 0.254: S4.3 24.07,73.4 | 24.07,73.4 S4.4 | S4.3 24.07,66.47 21.5,63.9 21,63.9 | R3.1 17.1,63.9 SBW.2 21,63.9 | 24.07,71.88 S4.3 | C15.1 24.07,73.4 | IC1.24 21.6,51 23,52.4 23,59 23,59.4 23,61.9 21,63.9
SPICLK
  Top 0.254: U$1.2 11.13,52.65 R32.2
SPICSN
  Top 0.254: U$1.4 8.6,52.65 R31.2
SPISI
  Top 0.254: U$1.1 12.5,50.72 R29.2
SPISO  (via drill 0.6)
  Top 0.254: v15,56 15.5,55.5 R30.2
  Bottom 0.254: IC1.5 9.7,55.7 10,56 v15,56
SW-CFG-GPS
  Bottom 0.254: IC1.37 22.1,44.5 24.2,42.4 24.2,35.86 S1.3 S1.4
VBUS
  Top 0.254: C27.+ 7.9,18.4 | R27.1 7.9,20.7 7.9,20.4 | 29.6,17.3 29.6,17.1
  Top 0.406: 29.6,17.1 IC3.20 25.11,17.07 arc-45 C21.2
  Top 0.61: FUSE1.1 6.6,20.4 | 6.6,20.4 7.9,20.4 7.9,18.4 9.85,18.4 U$4.3 10.15,16.7 12.05,16.7 U$4.1 | 29.47,22.2 6.85,22.2 arc90 6.6,21.95 6.6,20.4 | 29.47,22.2 arc90 29.73,22.45 C28.+ | 29.47,22.2 arc-90 29.6,22.07 29.6,17.3
VCC  (via drill 0.6)
  Top 0.254: 7.25,59.75 7,60 | 1.8,44.5 1.6,44.3 | C2.2 9.86,42.69 U$1.6 | R2.2 v14,58.5 | R1.1 8.2,39.85
  Top 0.61: C2.2 C1.2 10.55,37.75 10.5,37.7 | v2.6,44.5 1.8,44.5 | v8.2,37.7 8.5,38 R1.1
  Top 1.27: v2.88,53.98 3.3,54.4 3.3,58 v5.3,60 7,60 10.9,60 | 2.77,53.88 v2.88,53.98 | v2.88,53.98 1.6,52.7 1.6,44.3 1.6,38 1.8,37.7 4.08,37.7 | 4.08,37.7 v8.2,37.7 10.5,37.7 12.4,37.7 v13.1,37 | 4.08,37.7 S2.3.2 S2.3.1
  Bottom 0.254: IC1.47 14.2,38.5 C5.2 | C3.2 4.2,52.6 4.8,52 IC1.79 | IC1.64 3.45,44.5 | IC1.60 7.7,39.4 C12.2 | C7.1 21.2,52.3 20.9,52 IC1.22 | R3.2 16.3,61.3 13.8,58.5 | 24.8,30.8 S1.1 24.7,30.8 18.3,30.8 S1.2 18.2,30.8 4.2,30.8 4.08,30.92 S2.3.1 | v14,58.5 13.5,58.5
  Bottom 0.61: C8.1 C7.1 | C10.1 3.45,44.5 | 3.45,44.5 C9.1 | C3.2 C4.2 1.85,52.95 v2.88,53.98 | C11.2 C12.2 8.2,38.7 v8.2,37.7 | 3.45,44.5 v2.6,44.5
  Bottom 1.27: v10.8,60 11.2,60 12.7,58.5 13.5,58.5 13.8,58.5 v14,58.5 20.8,58.5 21.2,58.1 C8.1 | v10.8,60 v5.3,60 8.6,60 R18.2 | v10.8,60 10.1,60.7 R25.2 | v13.1,37 14.25,37 C6.2 C5.2
VCC_BATT_IN
  Bottom 0.305: U$2.7 11.05,72.65 11.35,72.95 11.55,72.95 | 11.55,72.95 12.05,72.95 | U$2.8 11.55,72.95
  Bottom 1.016: C25.1 13.8,72.95 | 13.8,72.95 12.05,72.95 | 13.8,72.95 15.63,72.95 arc-90 G2.+
VCCUSB  (via drill 0.6)
  Top 0.254: LED2.2 LED2.4
  Top 0.406: 37.67,13.82 arc90 R10.1 37.85,13.82 IC3.4 31.4,13.82 31.4,10.1 | LED2.2 21.7,10.1 31.4,10.1 | 31.4,10.1 R9.1 | LED2.4 20.3,10 v19.3,9 | v14,12.4 14,15.22 C22.+
  Top 0.61: C22.+ 12.22,15.32 U$4.5 | JP1.1 42.89,9.09 42.4,8.6 42.4,6.1 40.4,4.1 38.4,4.1 36.9,5.6 36.9,9.15 R9.1
  Bottom 0.406: v19.3,9 17.4,9 v14,12.4
VCCUSBGPS  (via drill 0.6)
  Top 0.254: v6.6,75.5 arc-90 6.7,75.6 R4.1 8.95,76.6 17.6,76.6 R7.2
  Bottom 0.406: 8,72.6 8.05,72.55 U$2.1 | U$2.2 8.55,72.05 7.8,72.8
  Bottom 0.61: C24.2 7.4,73.2 7.8,72.8 8,72.6
  Bottom 1.27: C24.2 6.95,75.15 v6.6,75.5 2.19,75.5 2,75.31 JP2.1
(copper drawn outside any net)
  shapes: Top area x2

### Text on the board
tText: PWRUSB | PWRBATT | TST-RST-GND | taGPS v3a | VCC | ADC-VREF | CFG GPS | GPS: ON - OFF | RX-USB-TX